# EAGLE design Ambilight-discovery_bachp_V1.2 (EAGLE 6.5.0)
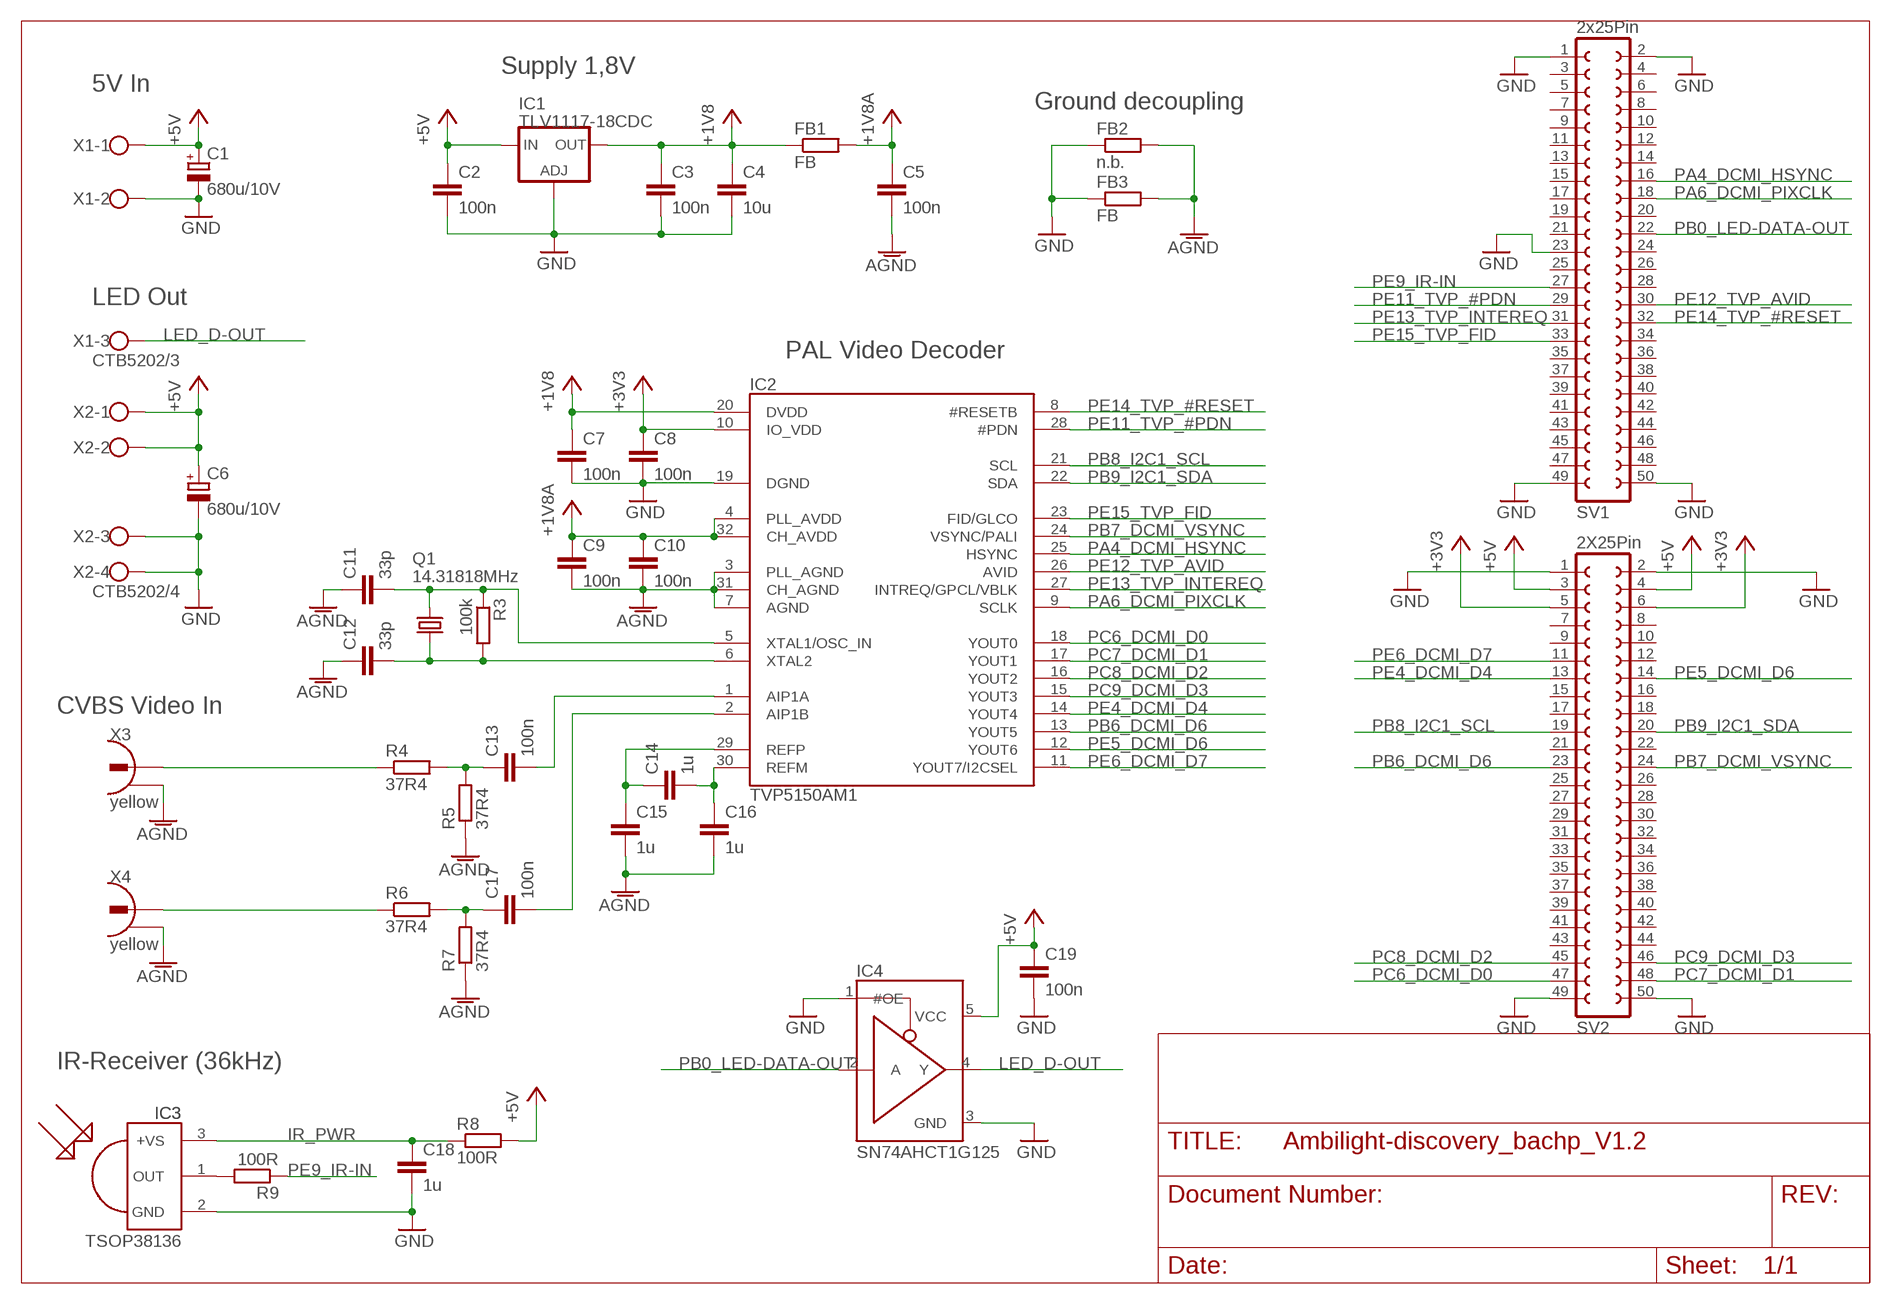
[diagram p0: schematic, sheet 1]

## Parts
C1  680u/10V  CPOL-EU153CLV-1012  [153CLV-1012]
C2  100n  C-EUC0805  [C0805]
C3  100n  C-EUC0805  [C0805]
C4  10u  C-EUC1210  [C1210]
C5  100n  C-EUC0805  [C0805]
C6  680u/10V  CPOL-EU153CLV-1012  [153CLV-1012]
C7  100n  C-EUC0805  [C0805]
C8  100n  C-EUC0805  [C0805]
C9  100n  C-EUC0805  [C0805]
C10  100n  C-EUC0805  [C0805]
C11  33p  C-EUC0805  [C0805]
C12  33p  C-EUC0805  [C0805]
C13  100n  C-EUC0805  [C0805]
C14  1u  C-EUC0805  [C0805]
C15  1u  C-EUC0805  [C0805]
C16  1u  C-EUC0805  [C0805]
C17  100n  C-EUC0805  [C0805]
C18  1u  C-EUC0805  [C0805]
C19  100n  C-EUC0805  [C0805]
FB1  FB  R-EU_R0805  [R0805]
FB2  n.b.  R-EU_R0805  [R0805]
FB3  FB  R-EU_R0805  [R0805]
IC1  TLV1117-18CDC  LD117AS18TR  [SOT223]
IC2  TVP5150AM1  [TQFP32-0.5MM]
IC3  TSOP38136  [TSOP38XXX]
IC4  SN74AHCT1G125  [SOT23-5L]
Q1  14.31818MHz  CRYSTALHC49UP  [HC49UP]
R3  100k  R-EU_R0805  [R0805]
R4  37R4  R-EU_R0805  [R0805]
R5  37R4  R-EU_R0805  [R0805]
R6  37R4  R-EU_R0805  [R0805]
R7  37R4  R-EU_R0805  [R0805]
R8  100R  R-EU_R0805  [R0805]
R9  100R  R-EU_R0805  [R0805]
SV1  2x25Pin  FE25-2  [FE25-2]
SV2  2X25Pin  FE25-2  [FE25-2]
X1  CTB5202/3  W237-103  [W237-103]
X2  CTB5202/4  W237-4  [W237-4]
X3  yellow  CINCH_JALCO  [CINCH_JALCO]
X4  yellow  CINCH_JALCO  [CINCH_JALCO]

## Nets
+1V8: C3.1 C4.1 C7.1 FB1.1 IC1.2(OUT) IC1.4(OUT) IC2.20(DVDD)
+1V8A: C5.1 C9.1 C10.1 FB1.2 IC2.4(PLL_AVDD) IC2.32(CH_AVDD)
+3V3: C8.1 IC2.10(IO_VDD) SV2.5 SV2.6
+5V: C1.+ C2.1 C6.+ C19.1 IC1.3(IN) IC4.5(VCC) R8.2 SV2.3 SV2.4 X1.1 X2.1 X2.2
AGND: C5.2 C9.2 C10.2 C11.1 C12.1 C15.2 C16.2 FB2.2 FB3.2 IC2.3(PLL_AGND) IC2.7(AGND) IC2.31(CH_AGND) R5.1 R7.1 X3.2 X4.2
GND: C1.- C2.2 C3.2 C4.2 C6.- C7.2 C8.2 C18.2 C19.2 FB2.1 FB3.1 IC1.1(ADJ) IC2.19(DGND) IC3.2(GND) IC4.1(#OE) IC4.3(GND) SV1.1 SV1.2 SV1.23 SV1.49 SV1.50 SV2.1 SV2.2 SV2.49 SV2.50 X1.2 X2.3 X2.4
IR_PWR: C18.1 IC3.3(+VS) R8.1
LED_D-OUT: IC4.4(Y) X1.3
N$1: C14.1 C15.1 IC2.29(REFP)
N$2: C14.2 C16.1 IC2.30(REFM)
N$3: C17.1 R6.2 R7.2
N$4: C17.2 IC2.2(AIP1B)
N$5: C13.2 IC2.1(AIP1A)
N$6: C13.1 R4.2 R5.2
N$7: R4.1 X3.1
N$8: C11.2 IC2.5(XTAL1/OSC_IN) Q1.1 R3.1
N$9: C12.2 IC2.6(XTAL2) Q1.2 R3.2
N$10: R6.1 X4.1
N$11: IC3.1(OUT) R9.2
PA4_DCMI_HSYNC: IC2.25(HSYNC) SV1.16
PA6_DCMI_PIXCLK: IC2.9(SCLK) SV1.18
PB0_LED-DATA-OUT: IC4.2(A) SV1.22
PB6_DCMI_D6: IC2.13(YOUT5) SV2.23
PB7_DCMI_VSYNC: IC2.24(VSYNC/PALI) SV2.24
PB8_I2C1_SCL: IC2.21(SCL) SV2.19
PB9_I2C1_SDA: IC2.22(SDA) SV2.20
PC6_DCMI_D0: IC2.18(YOUT0) SV2.47
PC7_DCMI_D1: IC2.17(YOUT1) SV2.48
PC8_DCMI_D2: IC2.16(YOUT2) SV2.45
PC9_DCMI_D3: IC2.15(YOUT3) SV2.46
PE4_DCMI_D4: IC2.14(YOUT4) SV2.13
PE5_DCMI_D6: IC2.12(YOUT6) SV2.14
PE6_DCMI_D7: IC2.11(YOUT7/I2CSEL) SV2.11
PE9_IR-IN: R9.1 SV1.27
PE11_TVP_#PDN: IC2.28(#PDN) SV1.29
PE12_TVP_AVID: IC2.26(AVID) SV1.30
PE13_TVP_INTEREQ: IC2.27(INTREQ/GPCL/VBLK) SV1.31
PE14_TVP_#RESET: IC2.8(#RESETB) SV1.32
PE15_TVP_FID: IC2.23(FID/GLCO) SV1.33
Unconnected: SV1.3 SV1.4 SV1.5 SV1.6 SV1.7 SV1.8 SV1.9 SV1.10 SV1.11 SV1.12 SV1.13 SV1.14 SV1.15 SV1.17 SV1.19 SV1.20 SV1.21 SV1.24 SV1.25 SV1.26 SV1.28 SV1.34 SV1.35 SV1.36 SV1.37 SV1.38 SV1.39 SV1.40 SV1.41 SV1.42 SV1.43 SV1.44 SV1.45 SV1.46 SV1.47 SV1.48 SV2.7 SV2.8 SV2.9 SV2.10 SV2.12 SV2.15 SV2.16 SV2.17 SV2.18 SV2.21 SV2.22 SV2.25 SV2.26 SV2.27 SV2.28 SV2.29 SV2.30 SV2.31 SV2.32 SV2.33 SV2.34 SV2.35 SV2.36 SV2.37 SV2.38 SV2.39 SV2.40 SV2.41 SV2.42 SV2.43 SV2.44

## Notes on the sheet
- Supply 1,8V
- 5V In
- Ground decoupling
- LED Out
- PAL Video Decoder
- CVBS Video In
- IR-Receiver (36kHz)

## Library data of the parts
C1 C6 = rcl:CPOL-EU: POLARIZED CAPACITOR, European symbol
C2-C5 C7-C19 = rcl:C-EU: CAPACITOR, European symbol
FB1-FB3 R3-R9 = rcl:R-EU_: RESISTOR, European symbol
IC1 = v-reg:LD117A?*: Low drop fixed and adjustable positive voltage regulators 1 A Source: http://www.st.com/stonline/products/literature/ds/7194/ld1117axx.pdf
IC2 = 1Eigene:TVP5150AM1: Texas Instuments TVP5150AM1 Ultralow-Power NTSC/PAL/SECAM Video Decoder TQFP32-0.5mm
IC3 = 1Eigene:TSOP38136: VISHAY TSOP38136 IR Receiver Modules for Remote Control Systems Supply voltage: 2.5 V to 5.5 V 1 = OUT, 2 = GND, 3 = VS SHORT BURST AND HIGH DATA RATE (AGC1) 36 kHz
IC4 = 1Eigene:SN74AHCT1G125: TEXAS INSTRUMENTS SN74AHCT1G125DBVR Single Bus Buffer Gate with 3-State Out (TTL kompatibel)
Q1 = crystal:CRYSTAL: CRYSTAL; OC_FARNELL: unknown; OC_NEWARK: unknown
SV1 SV2 = con-lsta:FE25-2: FEMALE HEADER; OC_FARNELL: unknown; OC_NEWARK: unknown
X1 = con-wago-500:W237-103: WAGO SCREW CLAMP; MPN: 237-103; OC_FARNELL: unknown; OC_NEWARK: 18M7116
X2 = con-wago-500:W237-4: WAGO SCREW CLAMP; OC_FARNELL: unknown; OC_NEWARK: unknown
X3 X4 = 1Eigene:CINCH_JALCO

## Board
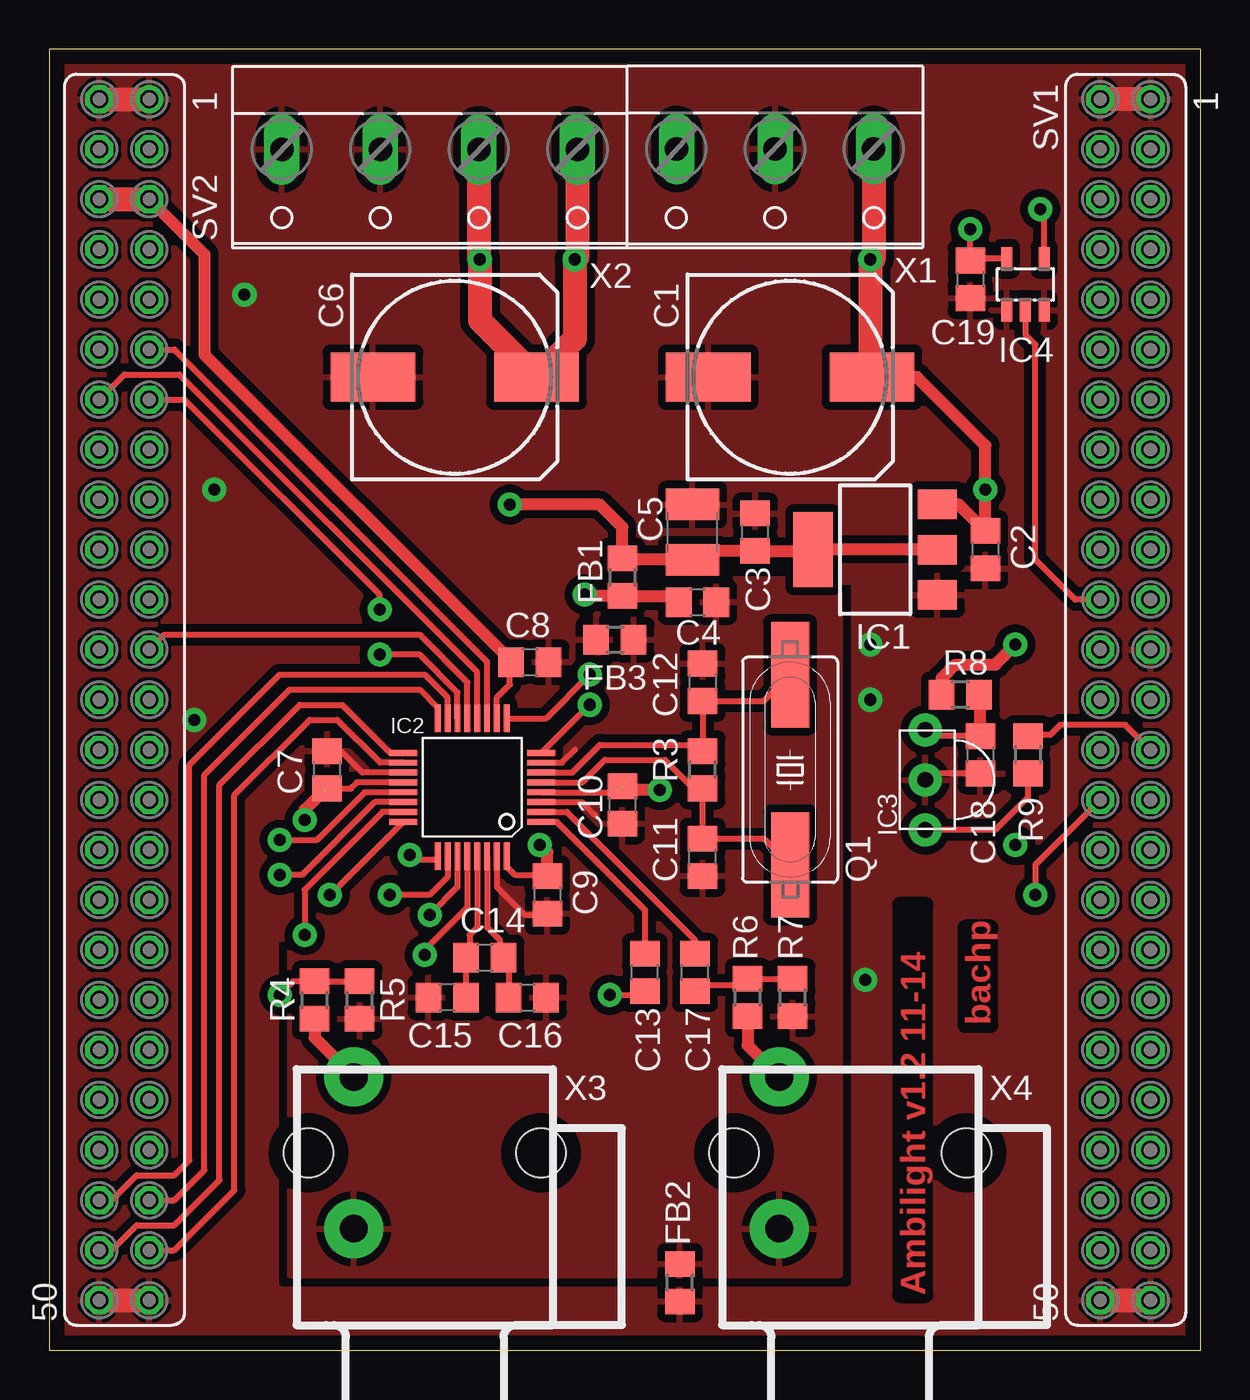
[diagram p1: board, top side]
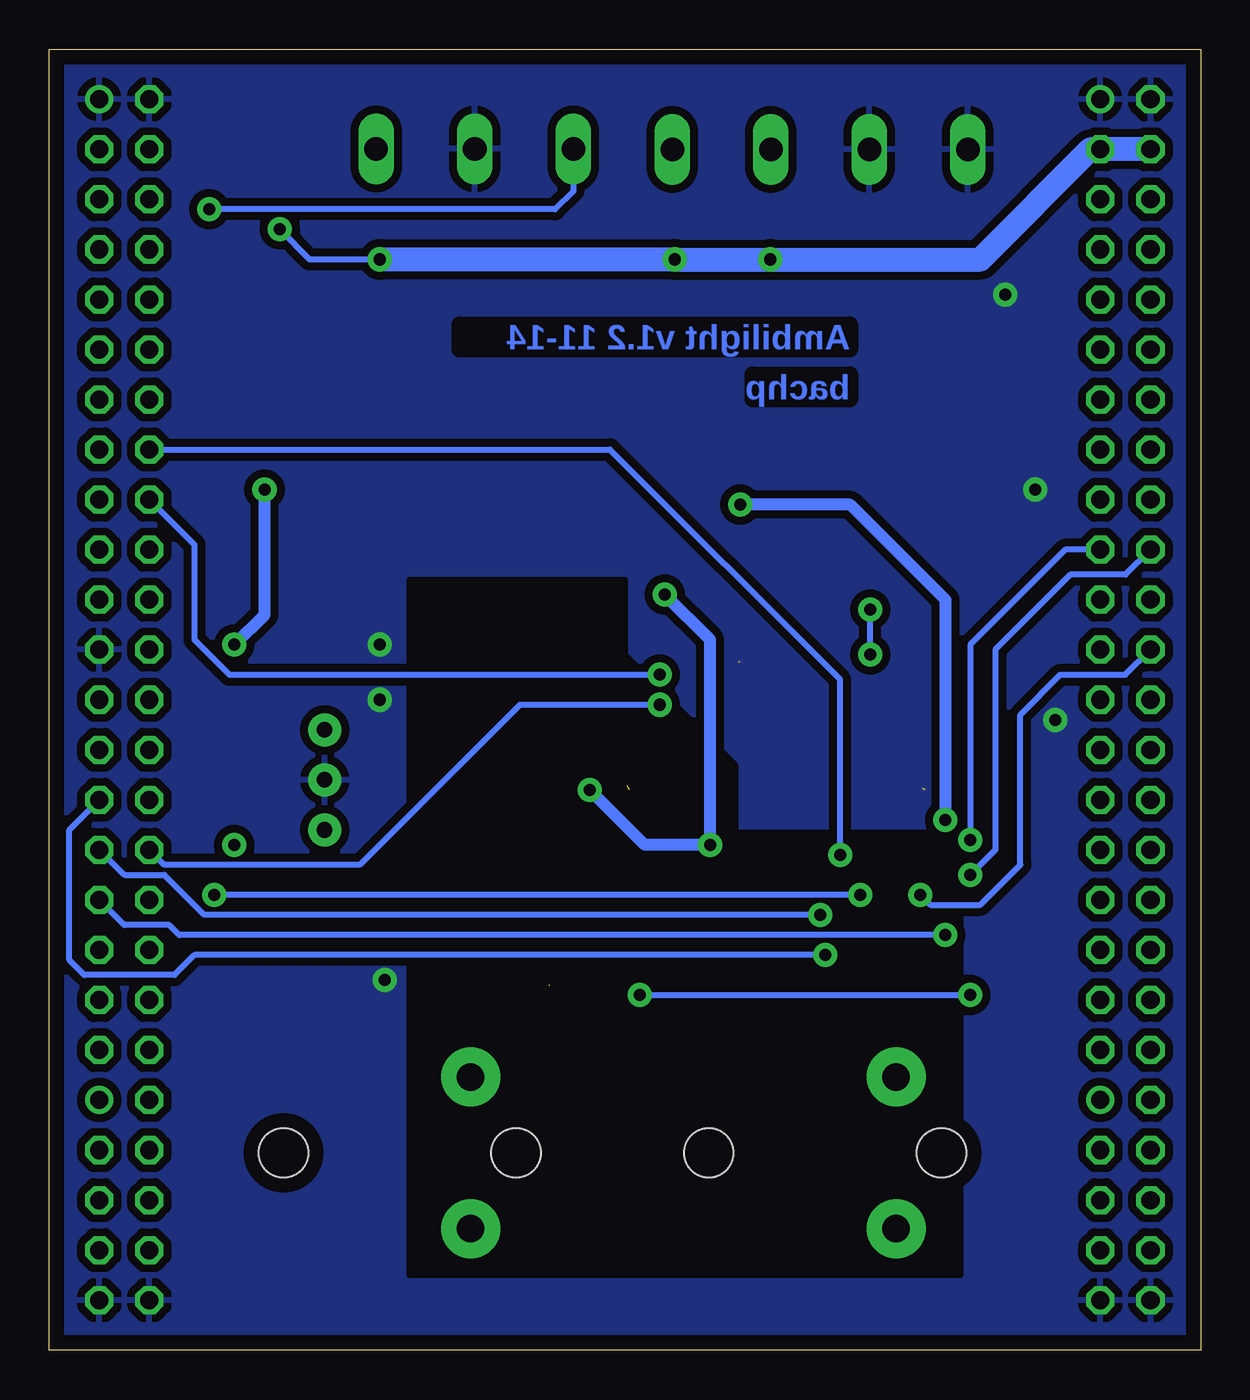
[diagram p2: board, bottom side, seen from below]

Size 58.42 x 66.04 mm. Coordinates in mm from the lower left corner, seen from the top.
Outline: 0,0 58.42,0 58.42,66.04 0,66.04 0,0
Copper layers (1*16): Top 0.035mm / dielectric 1.5mm / Bottom 0.035mm
Design rules "default *": minimum track width 10mil, minimum drill 24mil, track to track 7mil, track to pad 7mil, pad to pad 7mil, via to via 8mil, smd to smd 7mil, copper to edge 30mil, drill to drill 8mil, minimum pad ring 10mil, minimum via ring 8mil, stop-mask expansion 4mil, vias tented up to drill 0mil, thermal gap 16mil

### Footprints (pad centres in the part's own frame; a part is rotated, then mirrored left to right if it is on the bottom)
153CLV-1012 = smd 4.3 x 2.5: + 4.15,0; - -4.15,0
C0805 = smd 1.3 x 1.5: 1 -0.95,0; 2 0.95,0
C1210 = smd 1.6 x 2.7: 1 -1.4,0; 2 1.4,0
R0805 = smd 1.3 x 1.5: 1 -0.95,0; 2 0.95,0
SOT223 = smd 1.5 x 2: 1 -2.3,-3.15; 2 0,-3.15; 3 2.3,-3.15 | smd 3.8 x 2: 4 0,3.15
TQFP32-0.5MM = smd 1.4 x 0.3: 1 -3.5,1.75; 2 -3.5,1.25; 3 -3.5,0.75; 4 -3.5,0.25; 5 -3.5,-0.25; 6 -3.5,-0.75; 7 -3.5,-1.25; 8 -3.5,-1.75; 17 3.5,-1.75; 18 3.5,-1.25; 19 3.5,-0.75; 20 3.5,-0.25; 21 3.5,0.25; 22 3.5,0.75; 23 3.5,1.25; 24 3.5,1.75 | smd 0.3 x 1.4: 9 -1.75,-3.5; 10 -1.25,-3.5; 11 -0.75,-3.5; 12 -0.25,-3.5; 13 0.25,-3.5; 14 0.75,-3.5; 15 1.25,-3.5; 16 1.75,-3.5; 25 1.75,3.5; 26 1.25,3.5; 27 0.75,3.5; 28 0.25,3.5; 29 -0.25,3.5; 30 -0.75,3.5; 31 -1.25,3.5; 32 -1.75,3.5
TSOP38XXX = drill 0.8 pad 1.676: 1 -2.54,0; 2 0,0; 3 2.54,0
SOT23-5L = smd 0.55 x 1.2: 1 -0.95,-1.3; 2 0,-1.3; 3 0.95,-1.3; 4 0.95,1.3; 5 -0.95,1.3
HC49UP = smd 5.334 x 1.93: 1 -4.826,0; 2 4.826,0
FE25-2 = drill 0.914: 1 -30.48,1.27; 41 20.32,1.27 | drill 0.914 octagon: 2 -30.48,-1.27; 3 -27.94,1.27; 4 -27.94,-1.27; 5 -25.4,1.27; 6 -25.4,-1.27; 7 -22.86,1.27; 8 -22.86,-1.27; 9 -20.32,1.27; 10 -20.32,-1.27; 11 -17.78,1.27; 12 -17.78,-1.27; 13 -15.24,1.27; 14 -15.24,-1.27; 15 -12.7,1.27; 16 -12.7,-1.27; 17 -10.16,1.27; 18 -10.16,-1.27; 19 -7.62,1.27; 20 -7.62,-1.27; 21 -5.08,1.27; 22 -5.08,-1.27; 23 -2.54,1.27; 24 -2.54,-1.27; 25 0,1.27; 26 0,-1.27; 27 2.54,1.27; 28 2.54,-1.27; 29 5.08,1.27; 30 5.08,-1.27; 31 7.62,1.27; 32 7.62,-1.27; 33 10.16,1.27; 34 10.16,-1.27; 35 12.7,1.27; 36 12.7,-1.27; 37 15.24,1.27; 38 15.24,-1.27; 39 17.78,1.27; 40 17.78,-1.27; 42 20.32,-1.27; 43 22.86,1.27; 44 22.86,-1.27; 45 25.4,1.27; 46 25.4,-1.27; 47 27.94,1.27; 48 27.94,-1.27; 49 30.48,1.27; 50 30.48,-1.27
W237-103 = drill 1.194 long: 1 -5,-1.29; 2 0,-1.29; 3 5,-1.29
W237-4 = drill 1.194 long: 1 -7.5,-1.27; 2 -2.5,-1.27; 3 2.5,-1.27; 4 7.5,-1.27
CINCH_JALCO = drill 1.4 pad 3: 1 12.6,3.6; 2 4.9,3.6 | hole 2.5: 8.75,5.9; 8.75,-5.9

### Placement (x,y rotation side)
C1  37.59,49.4 0 top
C2  47.5,40.64 270 top
C3  35.81,41.53 90 top
C4  32.64,41.53 90 top
C5  32.89,37.97 0 top
C6  20.57,49.4 0 top
C7  14.1,29.46 90 top
C8  24.38,34.92 0 top
C9  25.27,23.11 270 top
C10  29.08,27.69 270 top
C11  33.15,25.02 90 top
C12  33.15,33.91 270 top
C13  30.23,19.18 90 top
C14  22.1,19.94 0 top
C15  20.19,17.91 180 top
C16  24.26,17.91 0 top
C17  32.77,19.18 90 top
C18  47.24,30.23 270 top
C19  46.74,54.36 270 top
FB1  29.08,39.24 270 top
FB2  32,3.43 90 top
FB3  28.7,36.07 0 top
IC1  41.91,40.64 90 top
IC2  21.46,28.57 180 top
IC3  44.45,28.96 90 top
IC4  49.53,54.1 0 top
Q1  37.59,29.46 90 top
R3  33.15,29.46 90 top
R4  13.46,17.78 90 top
R5  15.75,17.78 90 top
R6  35.43,17.91 90 top
R7  37.72,17.91 90 top
R8  46.23,33.27 180 top
R9  49.66,30.23 270 top
SV1  54.61,33.02 270 top
SV2  3.81,33.02 270 top
X1  36.83,59.69 180 top
X2  19.3,59.69 180 top
X3  19.05,1.27 90 top
X4  40.64,1.27 90 top

### Tracks (layer width: path | path; a pad name or v marks a point on that pad's centre or on a via)
+1V8  (via drill 0.61 pad 1.22)  (1 unrouted)
  Top 0.305: IC2.20 15.62,28.82 15.31,28.51 C7.1
  Top 0.61: v12.95,26.92 12.95,27.43 13.97,28.45 | IC1.2 IC1.4 38.7,40.58 C3.1 33.09,40.58 C4.1 29.15,40.13 FB1.1 29.08,41.78 27.94,42.93 v23.37,42.93
  Bottom 0.61: v12.95,26.92 12.95,38.1 17.78,42.93 v23.37,42.93
+1V8A  (via drill 0.61 pad 1.22)  (1 unrouted)
  Top 0.305: IC2.4 28.77,28.32 C10.1 | IC2.32 23.21,24.54 23.62,24.13 25.21,24.13 C9.1
  Top 0.61: C9.1 25.27,25.27 v24.89,25.65 | C5.1 31.62,38.29 FB1.2 27.18,38.29 v27.18,38.35 | v30.99,28.45 28.96,28.45
  Bottom 0.61: v27.18,38.35 24.89,36.07 v24.89,25.65 28.19,25.65 v30.99,28.45
+3V3  (1 unrouted)
  Top 0.305: IC2.10 22.71,33.13 23.37,33.78 23.37,34.86 C8.1
  Top 0.61: SV2.5 7.87,55.63 7.87,50.55 23.37,35.05 23.37,34.99
  Top 1.219: SV2.6 SV2.5
+5V  (via drill 0.61 pad 1.22)
  Top 0.305: IC4.5 46.83,55.4 C19.1 v46.74,56.9
  Top 0.61: IC1.3 46.15,42.94 C2.1 v47.5,43.69 47.5,45.93 44.03,49.4 C1.+ | R8.2 45.28,34.1 45.97,34.8 48.01,34.8 v49.02,35.81
  Top 1.219: X2.1 26.8,55.51 v26.67,55.37 26.67,51.35 C6.+ 21.84,52.28 v21.84,55.37 21.8,55.41 X2.2 | 41.71,49.44 C1.+ 41.66,49.4 v41.66,55.37 41.83,55.37 X1.1
  Bottom 0.305: v41.66,55.37 45.21,55.37 v46.74,56.9
  Bottom 0.61: v49.02,35.81 47.5,37.34 v47.5,43.69
  Bottom 1.219: SV2.4 SV2.3 5.59,60.96 11.18,55.37 v21.84,55.37 v26.67,55.37 v41.66,55.37
AGND
  Top 0.305: IC2.31 22.71,23.52 24.13,22.1 25.21,22.1 C9.2 | IC2.3 27.04,27.82 27.69,27.18 | IC2.7 26.02,29.82 26.67,30.48
  pour Top (isolate 0.406): 29.21,39.12 29.21,35.31 23.62,29.72 23.62,26.29 12.19,26.29 12.19,3.81 40.13,3.81 40.13,39.12
  cutout Bottom (isolate 0.406): 29.21,39.12 29.21,35.31 23.62,29.72 23.62,26.29 12.19,26.29 12.19,3.81 40.13,3.81 40.13,39.12
GND  (via drill 0.61 pad 1.22)
  Top 0.305: IC2.19 15.89,29.32 14.8,30.41 C7.2 | C18.2 44.77,29.28 IC3.2
  Top 1.219: SV1.1 SV1.2 | SV2.2 SV2.1 | SV2.50 SV2.49 | SV1.50 SV1.49
  other vias: 9.91,53.59 7.37,32 41.4,18.8 8.38,43.69 41.66,35.81 41.66,33.02
  pour Top (isolate 0.406, rank 2): 0,66.04 58.42,66.04 58.42,0 0,0
  pour Bottom (isolate 0.406, rank 2): 0,66.04 58.42,66.04 58.42,0 0,0
IR_PWR
  Top 0.305: C18.1 44.77,31.18 IC3.3
  Top 0.61: C18.1 47.24,33.21 R8.1
LED_D-OUT  (via drill 0.61 pad 1.22)
  Top 0.305: IC4.4 50.48,57.72 v50.29,57.91
  Bottom 0.305: v50.29,57.91 32.77,57.91 31.83,58.85 X1.3
N$1
  Top 0.305: IC2.29 21.71,21.46 21.34,21.08 21.34,20.13 C14.1 C15.1
N$2
  Top 0.305: IC2.30 22.21,21.48 22.86,20.83 22.86,20.13 C14.2 23.31,19.68 C16.1
N$3  (1 unrouted)
  Top 0.305: 32.96,18.48 33.02,18.54 | R7.2 R6.2 35.12,18.54 33.08,18.54 C17.1
N$4
  Top 0.305: IC2.2 26.27,27.32 32.77,20.83 C17.2
N$5
  Top 0.305: IC2.1 25.75,26.82 30.23,22.35 C13.2
N$6  (via drill 0.61 pad 1.22)
  Top 0.305: v28.45,18.03 30.03,18.03 C13.1 | R5.2 R4.2 12.38,18.73 v11.68,18.03
  Bottom 0.305: v28.45,18.03 v11.68,18.03
N$7
  Top 0.61: R4.1 13.46,15.86 X3.1
N$8
  Top 0.305: Q1.1 36.26,25.97 C11.2 R3.1 | IC2.5 27.05,28.82 28.19,29.97 31.24,29.97 32.51,28.7 32.96,28.7 R3.1 | 33.08,28.45 R3.1
N$9
  Top 0.305: Q1.2 36.26,32.96 C12.2 R3.2 | IC2.6 26.53,29.32 27.94,30.73 33.27,30.73 33.27,30.54 R3.2 | 33.08,30.48 R3.2
N$10
  Top 0.61: R6.1 35.43,15.48 X4.1
N$11
  Top 0.305: R9.2 49.66,28.07 48.01,26.42 IC3.1
N$14  (via drill 0.61 pad 1.22)
  other vias: 49.02,25.65
PA4_DCMI_HSYNC  (via drill 0.61 pad 1.22)
  Top 0.305: IC2.25 19.71,24.89 18.54,24.89 v18.29,25.15
  Bottom 0.305: v18.29,25.15 18.29,34.04 29.97,45.72 SV1.16
PA6_DCMI_PIXCLK  (via drill 0.61 pad 1.22)
  Top 0.305: IC2.9 25.22,32.08 v27.43,34.29
  Bottom 0.305: v27.43,34.29 49.28,34.29 51.05,36.07 51.05,40.89 SV1.18
PB0_LED-DATA-OUT
  Top 0.305: SV1.22 52.07,38.1 50.04,40.13 50.04,51.05 49.53,51.56 IC4.2
PB6_DCMI_D6
  Top 0.305: SV2.23 5.84,36.32 18.8,36.32 21.21,33.91 IC2.13
PB7_DCMI_VSYNC  (via drill 0.61 pad 1.22)
  Top 0.305: v14.22,23.11 14.25,23.11 IC2.24
  Bottom 0.305: v14.22,23.11 13.72,22.61 11.18,22.61 9.14,24.64 9.14,32.26 7.11,34.29 3.81,34.29 SV2.24
PB8_I2C1_SCL  (via drill 0.61 pad 1.22)
  Top 0.305: IC2.21 16.01,28.32 13.59,25.91 v11.68,25.91
  Bottom 0.305: v11.68,25.91 11.68,35.81 6.86,40.64 SV2.19
PB9_I2C1_SDA  (via drill 0.61 pad 1.22)
  Top 0.305: IC2.22 16.52,27.82 12.83,24.13 v11.68,24.13
  Bottom 0.305: v11.68,24.13 10.41,25.4 10.41,35.56 6.6,39.37 3.81,39.37 SV2.20
PC6_DCMI_D0
  Top 0.305: SV2.47 6.35,5.08 9.4,8.13 9.4,28.19 13.21,32 14.61,32 16.78,29.82 IC2.18
PC7_DCMI_D1
  Top 0.305: SV2.48 3.17,5.08 4.45,6.35 6.35,6.35 8.64,8.64 8.64,28.7 12.7,32.77 14.86,32.77 17.3,30.32 IC2.17
PC8_DCMI_D2
  Top 0.305: SV2.45 6.35,7.62 7.87,9.14 7.87,29.21 12.19,33.53 18.8,33.53 19.71,32.61 IC2.16
PC9_DCMI_D3
  Top 0.305: SV2.46 3.17,7.62 4.45,8.89 6.35,8.89 7.11,9.65 7.11,29.72 11.68,34.29 19.05,34.29 20.21,33.13 IC2.15
PE4_DCMI_D4  (via drill 0.61 pad 1.22)
  Top 0.305: SV2.13 6.86,48.26 16.76,38.35 v16.76,37.59 | IC2.14 20.71,33.39 18.8,35.31 v16.76,35.31
  Bottom 0.305: v16.76,35.31 v16.76,37.59
PE5_DCMI_D6
  Top 0.305: IC2.12 21.71,34.42 6.6,49.53 3.81,49.53 SV2.14
PE6_DCMI_D7
  Top 0.305: SV2.11 6.35,50.8 22.21,34.94 IC2.11
PE9_IR-IN
  Top 0.305: SV1.27 54.61,31.75 51.31,31.75 50.8,31.24 49.72,31.24 R9.1
PE11_TVP_#PDN  (via drill 0.61 pad 1.22)
  Top 0.305: IC2.28 21.21,22.48 19.05,20.32 v19.05,20.07
  Bottom 0.305: v19.05,20.07 51.05,20.07 52.07,19.05 56.64,19.05 57.4,19.81 57.4,26.42 SV1.29
PE12_TVP_AVID  (via drill 0.61 pad 1.22)
  Top 0.305: IC2.26 20.21,24.02 19.3,23.11 v17.27,23.11 | SV1.30 50.04,24.64 v50.04,23.11
  Bottom 0.305: v17.27,23.11 v50.04,23.11
PE13_TVP_INTEREQ  (via drill 0.61 pad 1.22)
  Top 0.305: IC2.27 20.71,23.51 v19.3,22.1
  Bottom 0.305: v19.3,22.1 50.55,22.1 52.58,24.13 54.61,24.13 SV1.31
PE14_TVP_#RESET  (via drill 0.61 pad 1.22)
  Top 0.305: v27.43,32.77 27.4,32.77 IC2.8
  Bottom 0.305: v27.43,32.77 34.54,32.77 42.67,24.64 52.58,24.64 SV1.32
PE15_TVP_FID  (via drill 0.61 pad 1.22)
  Top 0.305: IC2.23 16.91,27.32 12.95,23.37 v12.95,21.08
  Bottom 0.305: v12.95,21.08 51.82,21.08 52.32,21.59 54.61,21.59 SV1.33

### Text on the board
Top: bachp | Ambilight v1.2 11-14
Bottom: Ambilight v1.2 11-14 | bachp